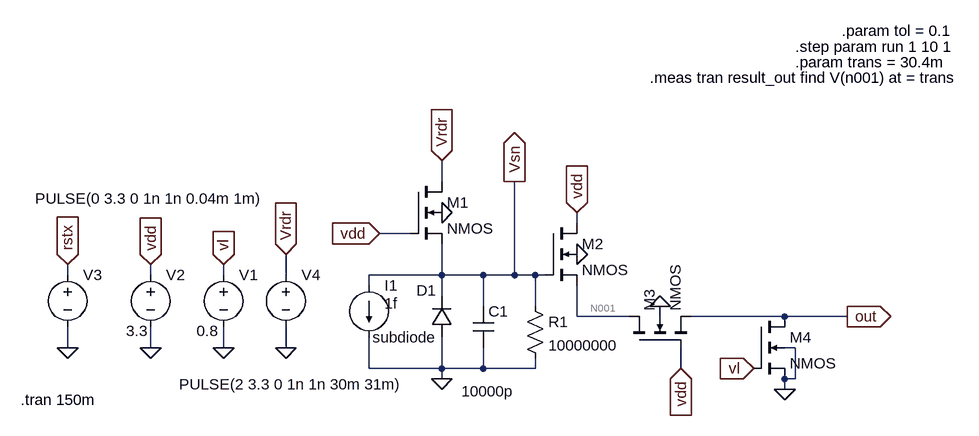
[diagram p0: schematic LOG 2015 Resistor.asc]
LOG 2015 Resistor.asc, the LTspice schematic file:
Version 4
SHEET 1 1372 680
WIRE 336 16 336 -16
WIRE 544 80 544 64
WIRE 288 96 240 96
WIRE -240 160 -240 144
WIRE -112 160 -112 144
WIRE 0 160 0 144
WIRE 96 160 96 128
WIRE 336 160 336 112
WIRE 336 160 224 160
WIRE 400 160 336 160
WIRE 448 160 448 16
WIRE 448 160 400 160
WIRE 480 160 448 160
WIRE 496 160 480 160
WIRE 224 176 224 160
WIRE 336 192 336 160
WIRE 400 208 400 160
WIRE 480 208 480 160
WIRE 544 224 544 176
WIRE 624 224 544 224
WIRE 672 224 672 208
WIRE 864 224 720 224
WIRE 960 224 864 224
WIRE -240 272 -240 240
WIRE -112 272 -112 240
WIRE 0 272 0 240
WIRE 96 272 96 240
WIRE 880 272 864 272
WIRE 224 304 224 256
WIRE 336 304 336 256
WIRE 336 304 224 304
WIRE 400 304 400 272
WIRE 400 304 336 304
WIRE 480 304 480 288
WIRE 480 304 400 304
WIRE 704 304 704 272
WIRE 336 320 336 304
WIRE 864 320 864 304
WIRE 880 320 880 272
WIRE 880 320 864 320
WIRE 864 336 864 320
FLAG 0 272 0
FLAG -112 272 0
FLAG -240 272 0
FLAG -240 144 rstx
IOPIN -240 144 In
FLAG 336 64 0
FLAG 336 320 0
FLAG 336 -16 Vrdr
IOPIN 336 -16 In
FLAG -112 144 vdd
IOPIN -112 144 In
FLAG 544 128 0
FLAG 864 336 0
FLAG 816 304 vl
IOPIN 816 304 In
FLAG 0 144 vl
IOPIN 0 144 In
FLAG 96 128 Vrdr
IOPIN 96 128 In
FLAG 96 272 0
FLAG 544 64 vdd
IOPIN 544 64 In
FLAG 672 208 0
FLAG 704 304 vdd
IOPIN 704 304 In
FLAG 960 224 out
IOPIN 960 224 Out
FLAG 240 96 vdd
IOPIN 240 96 In
FLAG 448 16 Vsn
IOPIN 448 16 Out
SYMBOL voltage 0 144 R0
WINDOW 123 0 0 Left 2
WINDOW 39 0 0 Left 2
WINDOW 3 -41 102 Left 2
SYMATTR InstName V1
SYMATTR Value 0.8
SYMBOL voltage -112 144 R0
WINDOW 123 0 0 Left 2
WINDOW 39 0 0 Left 2
WINDOW 3 -38 102 Left 2
SYMATTR InstName V2
SYMATTR Value 3.3
SYMBOL voltage -240 144 R0
WINDOW 123 24 132 Left 2
WINDOW 39 0 0 Left 2
WINDOW 3 -50 -102 Left 2
SYMATTR InstName V3
SYMATTR Value PULSE(0 3.3 0 1n 1n 0.04m 1m)
SYMBOL nmos4 288 16 R0
SYMATTR InstName M1
SYMATTR Value2 l={mc(35u,tol)} w={mc(70u,tol)}
SYMBOL nmos4 496 80 R0
SYMATTR InstName M2
SYMATTR Value2 l={mc(35u,tol)} w={mc(70u,tol)}
SYMBOL nmos4 816 224 R0
SYMATTR InstName M4
SYMBOL diode 352 256 R180
WINDOW 0 24 72 Left 2
WINDOW 3 24 0 Left 2
SYMATTR InstName D1
SYMATTR Value subdiode
SYMBOL current 224 176 R0
WINDOW 3 24 28 Left 2
WINDOW 123 0 0 Left 2
WINDOW 39 0 0 Left 2
SYMATTR Value 1f
SYMATTR InstName I1
SYMBOL voltage 96 144 R0
WINDOW 123 0 0 Left 2
WINDOW 39 0 0 Left 2
WINDOW 3 8 200 Bottom 2
SYMATTR Value PULSE(2 3.3 0 1n 1n 30m 31m)
SYMATTR InstName V4
SYMBOL nmos4 624 272 R270
SYMATTR InstName M3
SYMATTR Value2 l={mc(35u,tol)} w={mc(70u,tol)}
SYMBOL cap 384 208 R0
WINDOW 3 -18 131 Left 2
SYMATTR InstName C1
SYMATTR Value 10000p
SYMBOL res 464 192 R0
SYMATTR InstName R1
SYMATTR Value 10000000
TEXT -312 352 Left 2 !.tran 150m
TEXT 952 -216 Left 2 !.param tol = 0.1
TEXT 880 -192 Left 2 !.step param run 1 10 1
TEXT 880 -168 Left 2 !.param trans = 30.4m
TEXT 656 -144 Left 2 !.meas tran result_out find V(n001) at = trans

The netlist it stands for:
* LOG 2015 Resistor.asc
V1 vl 0 0.8
V2 vdd 0 3.3
V3 rstx 0 PULSE(0 3.3 0 1n 1n 0.04m 1m)
M1 Vrdr vdd Vsn 0 NMOS l={mc(35u,tol)} w={mc(70u,tol)}
M2 vdd Vsn N001 0 NMOS l={mc(35u,tol)} w={mc(70u,tol)}
M4 out vl 0 0 NMOS
D1 0 Vsn subdiode
I1 Vsn 0 1f
V4 Vrdr 0 PULSE(2 3.3 0 1n 1n 30m 31m)
M3 N001 vdd out 0 NMOS l={mc(35u,tol)} w={mc(70u,tol)}
C1 Vsn 0 10000p
R1 Vsn 0 10000000
.model D D
.lib standard.dio
.model NMOS NMOS
.model PMOS PMOS
.lib standard.mos
.tran 150m
.param tol = 0.1
.step param run 1 10 1
.param trans = 30.4m
.meas tran result_out find V(n001) at = trans
.backanno
.end